# EAGLE design ltc_adaptor_v0 (EAGLE 6.3)
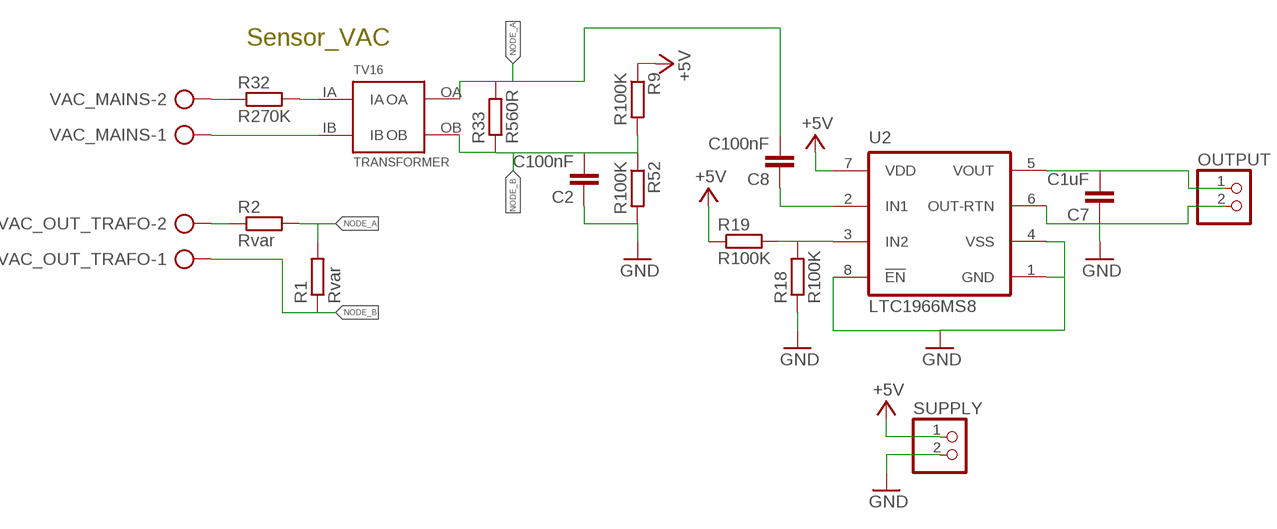
[diagram p0: schematic, sheet 1]

## Parts
C2  C100nF  C-EUC0805K  [C0805K]
C7  C1uF  C-EUC0805K  [C0805K]
C8  C100nF  C-EUC0805K  [C0805K]
OUTPUT  HEADER-1X2ROUND  [1X02_ROUND]
R1  Rvar  R-EU_R0805  [R0805]
R2  Rvar  R-EU_R0805  [R0805]
R9  R100K  R-EU_R0805  [R0805]
R18  R100K  R-EU_R0805  [R0805]
R19  R100K  R-EU_R0805  [R0805]
R32  R270K  R-EU_0309/10  [0309/10]
R33  R560R  R-EU_0309/10  [0309/10]
R52  R100K  R-EU_R0805  [R0805]
SUPPLY  HEADER-1X2ROUND  [1X02_ROUND]
TV16  TRANSFORMER  [TV16]
U2  LTC1966MS8  [MSOP08]
VAC_MAINS  AK300/2  [AK300/2]
VAC_OUT_TRAFO  AK300/2  [AK300/2]

## Nets
+5V: R9.1 R19.1 SUPPLY.1 U2.7(VDD)
GND: C2.1 C7.1 OUTPUT.2 R18.1 R52.2 SUPPLY.2 U2.1(GND) U2.4(VSS) U2.6(OUT-RTN) U2.8(!EN!)
N$1: R32.1 VAC_MAINS.2
N$2: TV16.IB VAC_MAINS.1
N$3: R2.1 VAC_OUT_TRAFO.2
N$4: C7.2 OUTPUT.1 U2.5(VOUT)
N$11: R18.2 R19.2 U2.3(IN2)
N$12: C8.1 U2.2(IN1)
N$36: R32.2 TV16.IA
NODE_A: C8.2 R1.2 R2.2 R33.2 TV16.OA
NODE_B: C2.2 R1.1 R9.2 R33.1 R52.1 TV16.OB VAC_OUT_TRAFO.1

## Notes on the sheet
- Sensor_VAC

## Library data of the parts
C2 C7 C8 = resistor:C-EU: CAPACITOR, European symbol
OUTPUT SUPPLY = microbuilder:HEADER-1X2: PIN HEADER
R1 R2 R9 R18 R19 R32 R33 R52 = resistor:R-EU_: RESISTOR, European symbol
TV16 = bontor:TRANSFORMER
U2 = linear-tech:LTC1966: RMS-to-DC Converter
VAC_MAINS VAC_OUT_TRAFO = con-ptr500:AK300/2: CONNECTOR; OC_FARNELL: unknown; OC_NEWARK: unknown

## Board
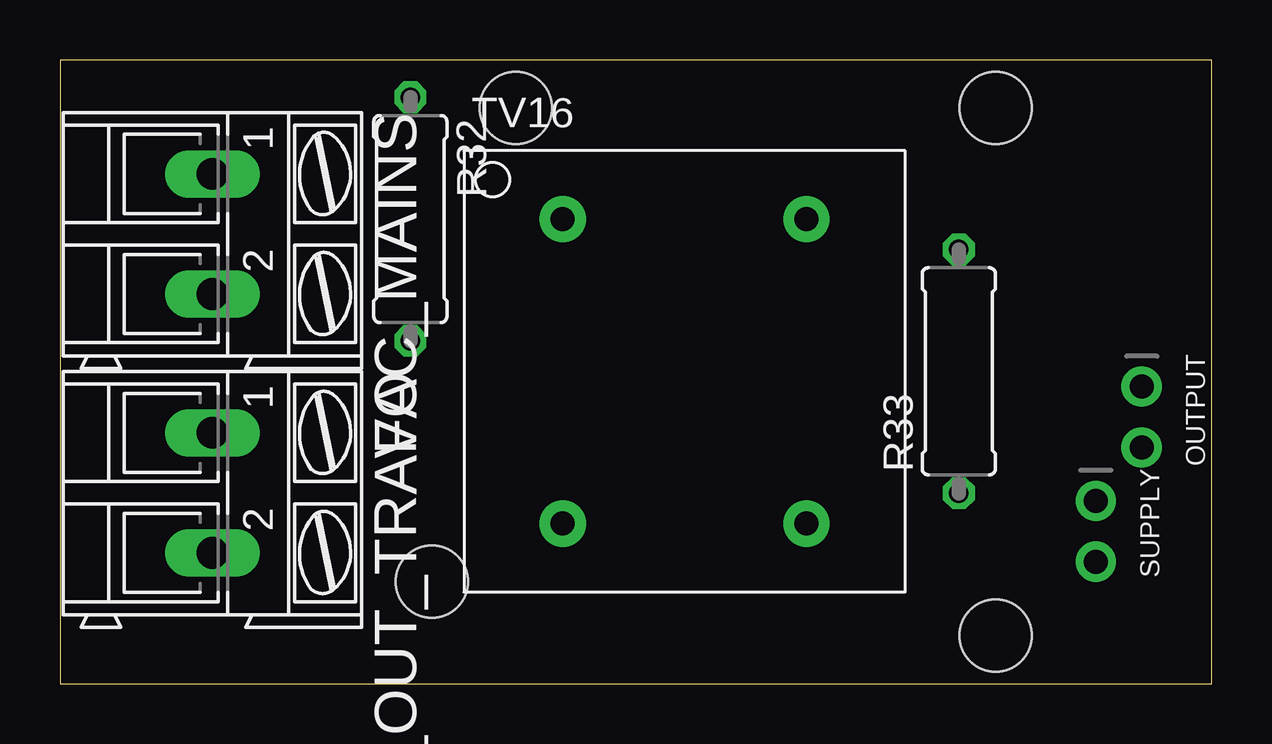
[diagram p1: board, top side]
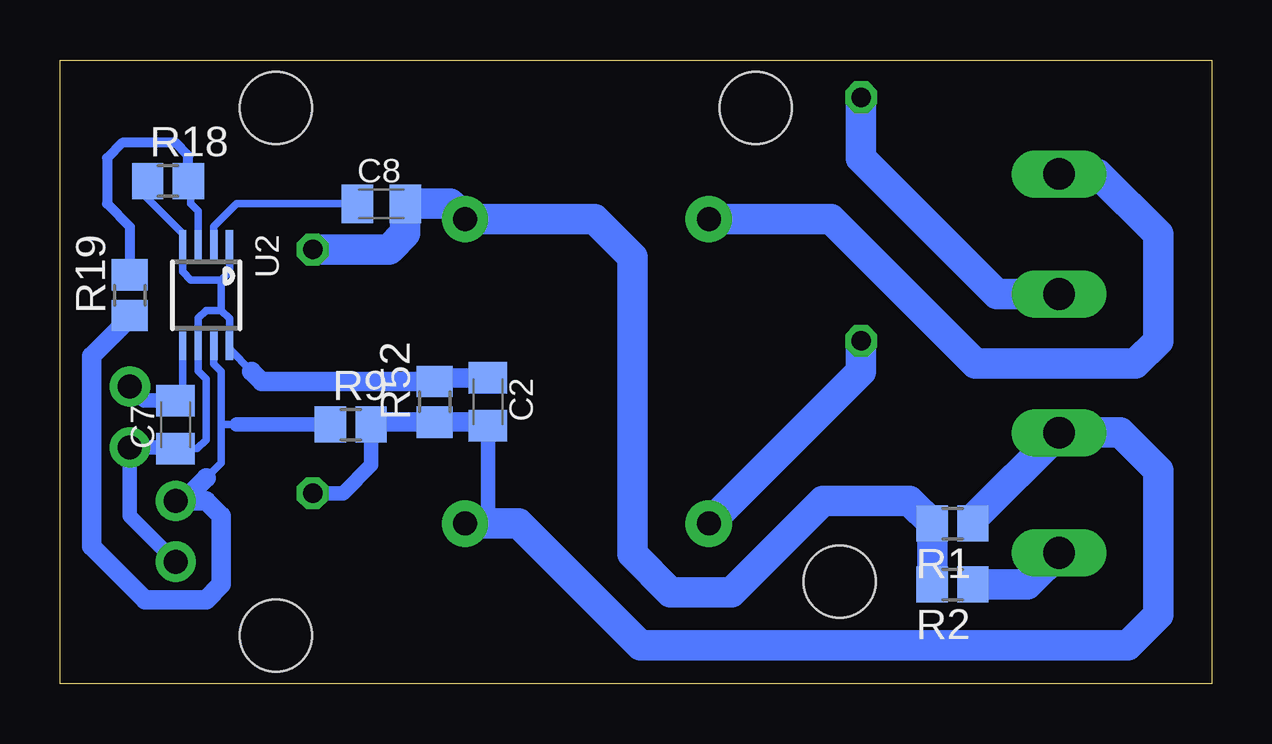
[diagram p2: board, bottom side, seen from below]

Size 48 x 26 mm. Coordinates in mm from the lower left corner, seen from the top.
Outline: 0,0 48,0 48,26 0,26 0,0
Copper layers (1*16): Top 0.035mm / dielectric 1.5mm / Bottom 0.035mm
Design rules "default": minimum track width 10mil, minimum drill 24mil, track to track 8mil, track to pad 8mil, pad to pad 8mil, via to via 8mil, smd to smd 8mil, copper to edge 40mil, drill to drill 8mil, minimum pad ring 10mil, minimum via ring 8mil, stop-mask expansion 4mil, vias tented up to drill 0mil, thermal gap 10mil
Holes 3 mm at 39,24 39,2 19,24 15.5,4.25

### Footprints (pad centres in the part's own frame; a part is rotated, then mirrored left to right if it is on the bottom)
C0805K = smd 1.3 x 1.6: 1 -1,0; 2 1,0
1X02_ROUND = drill 1 pad 1.676: 1 -1.27,0; 2 1.27,0
R0805 = smd 1.3 x 1.5: 1 -0.85,0; 2 0.85,0
0309/10 = drill 0.813 octagon: 1 -5.08,0; 2 5.08,0
TV16 = drill 1 pad 1.93: IA -5.08,-6.35; IB -5.08,6.35; OA 5.08,6.35; OB 5.08,-6.35
MSOP08 = smd 0.3 x 1.2: 1 -0.976,-2.113; 2 -0.326,-2.113; 3 0.324,-2.113; 4 0.974,-2.113; 5 0.974,2.112; 6 0.324,2.112; 7 -0.326,2.112; 8 -0.976,2.112
AK300/2 = drill 1.321 long: 1 -2.515,0; 2 2.489,0

### Placement (x,y rotation side)
C2  30.16,11.75 270 bottom
C7  43.18,10.79 90 bottom
C8  34.61,20 0 bottom
OUTPUT  45.09,11.11 270 top
R1  10.79,6.67 180 bottom
R2  10.79,4.13 180 bottom
R9  35.88,10.79 0 bottom
R18  43.5,20.95 0 bottom
R19  45.09,16.19 90 bottom
R32  14.61,19.37 270 top
R33  37.47,13.02 90 top
R52  32.38,11.75 90 bottom
SUPPLY  43.18,6.35 270 top
TV16  26.04,13.02 0 top
U2  41.91,16.19 180 bottom
VAC_MAINS  6.35,18.73 270 top
VAC_OUT_TRAFO  6.35,7.94 270 top

### Tracks (layer width: path | path; a pad name or v marks a point on that pad's centre or on a via)
+5V
  Bottom 0.305: U2.7 41.58,13.33 41.27,13.02 41.27,10.79 | 41.27,10.79 41.27,9.21 41.91,8.57 | 40.64,10.79 41.27,10.79
  Bottom 0.61: R9.1 40.64,10.79
  Bottom 0.813: R19.1 45.09,15.24 46.67,13.65 46.67,5.71 44.45,3.49 41.91,3.49 41.27,4.13 41.27,6.99 41.91,7.62 42.86,7.62 | SUPPLY.1 42.86,7.62 | 42.86,7.62 41.91,8.57
GND
  Bottom 0.305: U2.1 40.93,17.17 41.27,16.83 | 41.27,16.83 42.55,16.83 42.88,17.17 U2.4 42.88,18.75 44.45,20.32 44.45,20.85 R18.1 | 41.27,15.56 40.93,15.22 U2.8 40.93,13.95 40.01,13.02 | 41.27,15.56 41.91,15.56 42.23,15.23 U2.6 42.23,13.02 41.91,12.7 41.91,10.16 42.27,9.79 C7.1 | 41.27,15.56 41.27,16.83
  Bottom 0.61: SUPPLY.2 45.09,6.99 OUTPUT.2 43.23,9.84 C7.1
  Bottom 0.813: C2.1 32.23,12.75 R52.2 39.59,12.6 40.01,13.02
N$1
  Bottom 1.27: VAC_MAINS.2 8.94,16.24 14.61,21.91 R32.1
N$2
  Bottom 1.27: VAC_MAINS.1 4.74,21.25 2.22,18.73 2.22,14.29 3.17,13.34 9.84,13.34 15.88,19.37 TV16.IB
N$3
  Bottom 1.27: R2.1 7.67,4.13 VAC_OUT_TRAFO.2
N$4
  Bottom 0.305: U2.5 42.88,12.09 C7.2
  Bottom 0.61: C7.2 44.5,11.79 OUTPUT.1
N$11
  Bottom 0.305: U2.3 42.23,19.69 42.55,20 42.55,20.85 R18.2
  Bottom 0.406: R18.2 42.65,22.01 43.18,22.54 45.4,22.54 46.04,21.91 46.04,20 45.09,19.05 R19.2
N$12
  Bottom 0.305: U2.2 41.58,19.06 40.64,20 C8.1
N$36
  Bottom 1.27: R32.2 14.61,13.02 TV16.IA
NODE_A
  Bottom 1.27: R2.2 R1.2 12.6,7.62 16.19,7.62 20,3.81 22.54,3.81 24.13,5.4 24.13,17.78 25.72,19.37 TV16.OA 31.75,20 C8.2 33.61,18.78 34.29,18.1 R33.2
NODE_B
  Bottom 0.61: R9.2 35.03,9.11 36.2,7.94 R33.1 | C2.2 30.16,6.67
  Bottom 0.813: C2.2 30.31,10.9 R52.1 34.92,10.9 R9.2
  Bottom 1.27: R1.1 9.95,6.86 VAC_OUT_TRAFO.1 6.33,10.48 3.81,10.48 2.22,8.89 2.22,2.86 3.49,1.59 23.81,1.59 28.89,6.67 30.16,6.67 TV16.OB